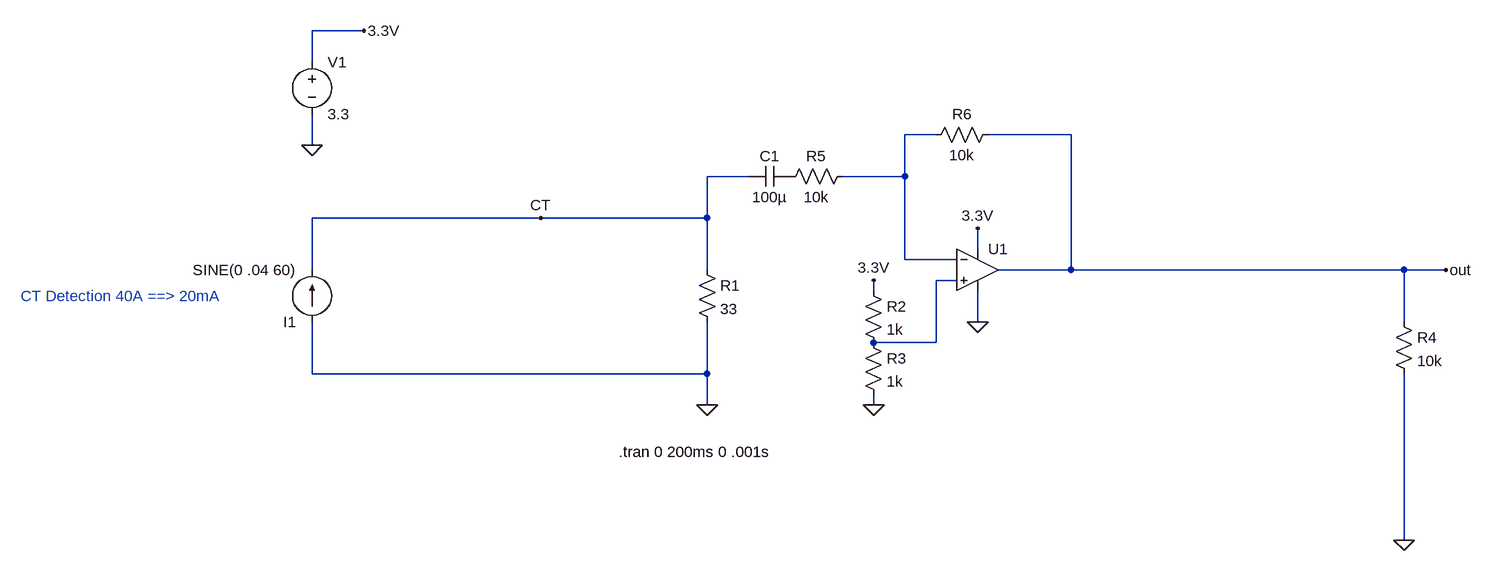
[diagram p0: schematic CT Clamping.asc]
CT Clamping.asc, the LTspice schematic file:
Version 4
SHEET 1 1904 680
WIRE 176 -240 96 -240
WIRE 96 -192 96 -240
WIRE 1056 -80 1008 -80
WIRE 1264 -80 1136 -80
WIRE 96 -64 96 -112
WIRE 768 -16 704 -16
WIRE 1008 -16 1008 -80
WIRE 1008 -16 912 -16
WIRE 448 48 96 48
WIRE 704 48 704 -16
WIRE 704 48 448 48
WIRE 1120 96 1120 64
WIRE 1008 112 1008 -16
WIRE 1088 112 1008 112
WIRE 96 128 96 48
WIRE 704 128 704 48
WIRE 1264 128 1264 -80
WIRE 1264 128 1152 128
WIRE 1776 128 1264 128
WIRE 1840 128 1776 128
WIRE 1088 144 1056 144
WIRE 960 160 960 144
WIRE 1120 208 1120 160
WIRE 1776 208 1776 128
WIRE 1056 240 1056 144
WIRE 1056 240 960 240
WIRE 96 288 96 208
WIRE 704 288 704 208
WIRE 704 288 96 288
WIRE 704 336 704 288
WIRE 960 336 960 320
WIRE 1776 544 1776 288
FLAG 1120 208 0
FLAG 1120 64 3.3V
FLAG 1840 128 out
FLAG 96 -64 0
FLAG 176 -240 3.3V
FLAG 1776 544 0
FLAG 704 336 0
FLAG 960 336 0
FLAG 960 144 3.3V
FLAG 448 48 CT
SYMBOL current 96 208 R180
WINDOW 123 0 0 Left 2
WINDOW 39 0 0 Left 2
SYMATTR InstName I1
SYMATTR Value SINE(0 .04 60)
SYMBOL res 688 112 R0
SYMATTR InstName R1
SYMATTR Value 33
SYMBOL res 944 144 R0
SYMATTR InstName R2
SYMATTR Value 1k
SYMBOL res 944 224 R0
SYMATTR InstName R3
SYMATTR Value 1k
SYMBOL voltage 96 -208 R0
SYMATTR InstName V1
SYMATTR Value 3.3
SYMBOL res 1760 192 R0
SYMATTR InstName R4
SYMATTR Value 10k
SYMBOL Opamps\\UniversalOpamp2 1120 128 R0
SYMATTR InstName U1
SYMBOL res 928 -32 R90
WINDOW 0 0 56 VBottom 2
WINDOW 3 32 56 VTop 2
SYMATTR InstName R5
SYMATTR Value 10k
SYMBOL res 1152 -96 R90
WINDOW 0 0 56 VBottom 2
WINDOW 3 32 56 VTop 2
SYMATTR InstName R6
SYMATTR Value 10k
SYMBOL cap 832 -32 R90
WINDOW 0 0 32 VBottom 2
WINDOW 3 32 32 VTop 2
SYMATTR InstName C1
SYMATTR Value 100µ
TEXT -352 168 Left 2 ;CT Detection 40A ==> 20mA
TEXT 568 408 Left 2 !.tran 0 200ms 0 .001s

The netlist it stands for:
* CT Clamping.asc
I1 0 CT SINE(0 .04 60)
R1 CT 0 33
R2 3.3V N002 1k
R3 N002 0 1k
V1 3.3V 0 3.3
R4 out 0 10k
XU1 N002 N001 3.3V 0 out level.2 Avol=1Meg GBW=10Meg Slew=10Meg ilimit=25m rail=0 Vos=0 phimargin=45 en=0 enk=0 in=0 ink=0 Rin=500Meg  ; pins IN+ IN- V+ V- OUT
R5 N001 P001 10k
R6 out N001 10k
C1 P001 CT 100µ
* CT Detection 40A ==> 20mA
.tran 0 200ms 0 .001s
.lib UniversalOpamps2.sub
.backanno
.end